# EAGLE design sensor board (EAGLE 7.7.0)
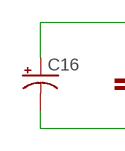
[diagram p0: schematic, sheet 1, part 1 of 2]
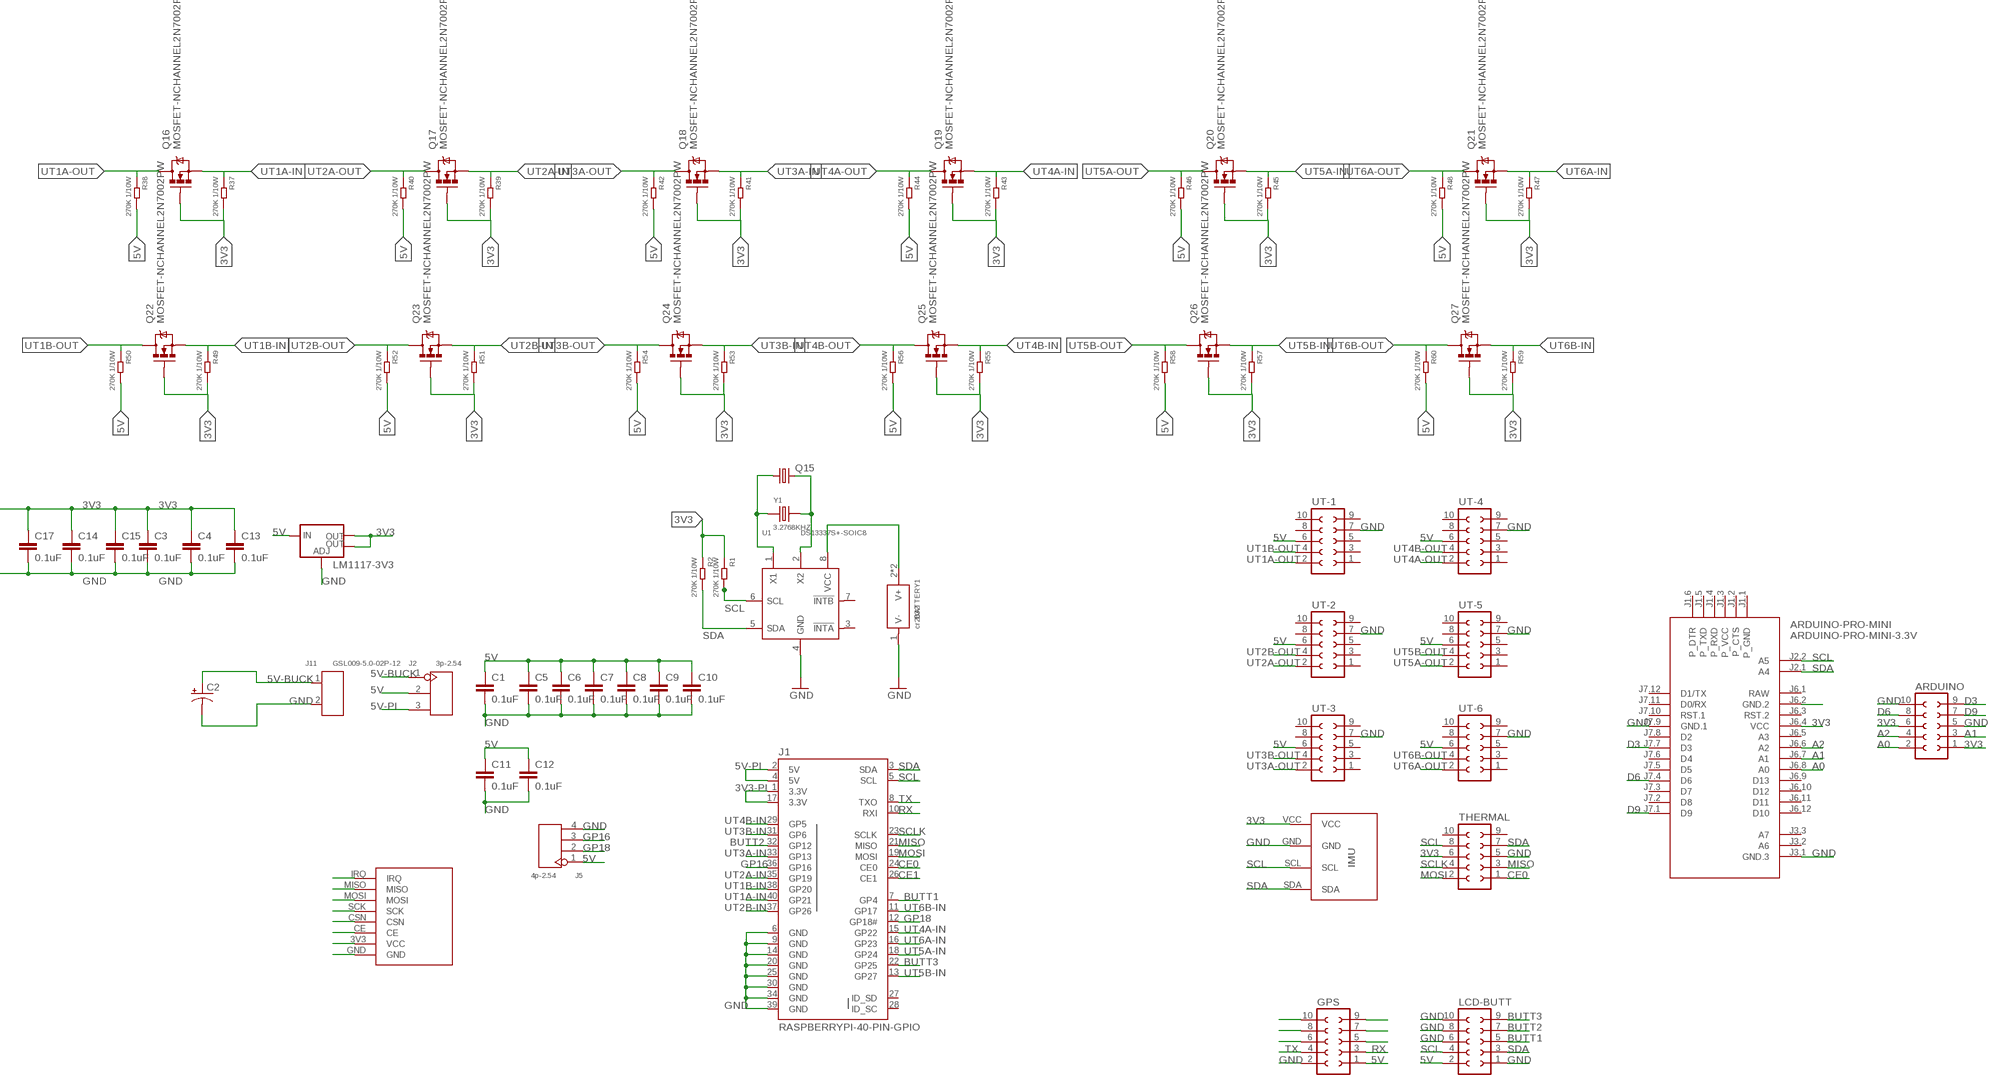
[diagram p1: schematic, sheet 1, part 2 of 2]

## Parts
ARDUINO  SOCKET-10V  [S10V]
ARDUINO-PRO-MINI  ARDUINO-PRO-MINI-3.3V  [ARDUINO-PRO-MINI]
BATTERY1  cr2032  DIP-BATTERY-CELL-HOLDER(2032)  [BAT2P-20.32-CR2032]
C1  0.1uF  0.1UF-100V-10%(0603)  [0603-CAP]
C2  100UF-25V-20%(PTH)  [CPOL-RADIAL-100UF-25V]
C3  0.1uF  0.1UF-100V-10%(0603)  [0603-CAP]
C4  0.1uF  0.1UF-100V-10%(0603)  [0603-CAP]
C5  0.1uF  0.1UF-100V-10%(0603)  [0603-CAP]
C6  0.1uF  0.1UF-100V-10%(0603)  [0603-CAP]
C7  0.1uF  0.1UF-100V-10%(0603)  [0603-CAP]
C8  0.1uF  0.1UF-100V-10%(0603)  [0603-CAP]
C9  0.1uF  0.1UF-100V-10%(0603)  [0603-CAP]
C10  0.1uF  0.1UF-100V-10%(0603)  [0603-CAP]
C11  0.1uF  0.1UF-100V-10%(0603)  [0603-CAP]
C12  0.1uF  0.1UF-100V-10%(0603)  [0603-CAP]
C13  0.1uF  0.1UF-100V-10%(0603)  [0603-CAP]
C14  0.1uF  0.1UF-100V-10%(0603)  [0603-CAP]
C15  0.1uF  0.1UF-100V-10%(0603)  [0603-CAP]
C16  100UF-25V-20%(PTH)  [CPOL-RADIAL-100UF-25V]
C17  0.1uF  0.1UF-100V-10%(0603)  [0603-CAP]
GPS  SOCKET-10V  [S10V]
J1  RASPBERRYPI-40-PIN-GPIO  [2X20-SHROUDED]
J2  3p-2.54  DIP-BLACK-FEMALE-HEADER-VERT(3P-2.54)  [H3-2.54]
J5  4p-2.54  DIP-BLACK-FEMALE-HEADER-VERT(4P-2.54)  [H4-2.54]
J11  GSL009-5.0-02P-12  SCREW-TERMINAL-BLUE(2P-5.0)  [H2-5.0-10.5X8.0MM]
LCD-BUTT  SOCKET-10V  [S10V]
LM1117-3V3  V_REG_LM1117SOT223  [SOT223]
Q15  CRYSTALTC26H  [TC26H]
Q16  MOSFET-NCHANNEL2N7002PW  [SOT323]
Q17  MOSFET-NCHANNEL2N7002PW  [SOT323]
Q18  MOSFET-NCHANNEL2N7002PW  [SOT323]
Q19  MOSFET-NCHANNEL2N7002PW  [SOT323]
Q20  MOSFET-NCHANNEL2N7002PW  [SOT323]
Q21  MOSFET-NCHANNEL2N7002PW  [SOT323]
Q22  MOSFET-NCHANNEL2N7002PW  [SOT323]
Q23  MOSFET-NCHANNEL2N7002PW  [SOT323]
Q24  MOSFET-NCHANNEL2N7002PW  [SOT323]
Q25  MOSFET-NCHANNEL2N7002PW  [SOT323]
Q26  MOSFET-NCHANNEL2N7002PW  [SOT323]
Q27  MOSFET-NCHANNEL2N7002PW  [SOT323]
R1  270K 1/10W  RC0603FR-0720RL(0603)  [R0603]
R2  270K 1/10W  RC0603FR-0720RL(0603)  [R0603]
R37  270K 1/10W  RC0603FR-0720RL(0603)  [R0603]
R38  270K 1/10W  RC0603FR-0720RL(0603)  [R0603]
R39  270K 1/10W  RC0603FR-0720RL(0603)  [R0603]
R40  270K 1/10W  RC0603FR-0720RL(0603)  [R0603]
R41  270K 1/10W  RC0603FR-0720RL(0603)  [R0603]
R42  270K 1/10W  RC0603FR-0720RL(0603)  [R0603]
R43  270K 1/10W  RC0603FR-0720RL(0603)  [R0603]
R44  270K 1/10W  RC0603FR-0720RL(0603)  [R0603]
R45  270K 1/10W  RC0603FR-0720RL(0603)  [R0603]
R46  270K 1/10W  RC0603FR-0720RL(0603)  [R0603]
R47  270K 1/10W  RC0603FR-0720RL(0603)  [R0603]
R48  270K 1/10W  RC0603FR-0720RL(0603)  [R0603]
R49  270K 1/10W  RC0603FR-0720RL(0603)  [R0603]
R50  270K 1/10W  RC0603FR-0720RL(0603)  [R0603]
R51  270K 1/10W  RC0603FR-0720RL(0603)  [R0603]
R52  270K 1/10W  RC0603FR-0720RL(0603)  [R0603]
R53  270K 1/10W  RC0603FR-0720RL(0603)  [R0603]
R54  270K 1/10W  RC0603FR-0720RL(0603)  [R0603]
R55  270K 1/10W  RC0603FR-0720RL(0603)  [R0603]
R56  270K 1/10W  RC0603FR-0720RL(0603)  [R0603]
R57  270K 1/10W  RC0603FR-0720RL(0603)  [R0603]
R58  270K 1/10W  RC0603FR-0720RL(0603)  [R0603]
R59  270K 1/10W  RC0603FR-0720RL(0603)  [R0603]
R60  270K 1/10W  RC0603FR-0720RL(0603)  [R0603]
THERMAL  SOCKET-10V  [S10V]
U1  DS13337S+-SOIC8  CLOCK-DS1337S+(SOIC8)  [SOIC8-1.27-5X4MM]
U$1  IMU  [IMU]
U$2  NRF24L01+  [NRF24L01+]
UT-1  SOCKET-10V  [S10V]
UT-2  SOCKET-10V  [S10V]
UT-3  SOCKET-10V  [S10V]
UT-4  SOCKET-10V  [S10V]
UT-5  SOCKET-10V  [S10V]
UT-6  SOCKET-10V  [S10V]
Y1  3.2768KHZ  SMD-CRYSTAL-32.768KHZ-12.5PF-20PPM-90K(2P-L2.0X1.2MM)  [X2-SMD-L2.0X1.2X0.55MM]

## Nets
3V3: ARDUINO-PRO-MINI.J6.4(VCC) ARDUINO.1 ARDUINO.6 C3.1 C4.1 C13.1 C14.1 C15.1 C16.1(+) C17.1 LM1117-3V3.2(OUT) LM1117-3V3.4(OUT) Q16.1(G) Q17.1(G) Q18.1(G) Q19.1(G) Q20.1(G) Q21.1(G) Q22.1(G) Q23.1(G) Q24.1(G) Q25.1(G) Q26.1(G) Q27.1(G) R1.1 R2.1 R37.2 R39.2 R41.2 R43.2 R45.2 R47.2 R49.2 R51.2 R53.2 R55.2 R57.2 R59.2 THERMAL.6 U$1.VCC U$2.3V3(VCC)
3V3-PI: J1.1(3.3V) J1.17(3.3V)
5V: C1.1 C5.1 C6.1 C7.1 C8.1 C9.1 C10.1 C11.1 C12.1 GPS.1 J2.2 J5.1 LCD-BUTT.2 LM1117-3V3.3(IN) R38.2 R40.2 R42.2 R44.2 R46.2 R48.2 R50.2 R52.2 R54.2 R56.2 R58.2 R60.2 UT-1.6 UT-2.6 UT-3.6 UT-4.6 UT-5.6 UT-6.6
5V-BUCK: C2.1(+) J2.1 J11.1
5V-PI: J1.2(5V) J1.4(5V) J2.3
A0: ARDUINO-PRO-MINI.J6.8(A0) ARDUINO.2
A1: ARDUINO-PRO-MINI.J6.7(A1) ARDUINO.3
A2: ARDUINO-PRO-MINI.J6.6(A2) ARDUINO.4
BUTT1: J1.7(GP4) LCD-BUTT.5
BUTT2: J1.32(GP12) LCD-BUTT.7
BUTT3: J1.22(GP25) LCD-BUTT.9 U$2.CE
CE0: J1.24(CE0) THERMAL.1
CE1: J1.26(CE1) U$2.CSN
D3: ARDUINO-PRO-MINI.J7.7(D3) ARDUINO.9
D6: ARDUINO-PRO-MINI.J7.4(D6) ARDUINO.8
D9: ARDUINO-PRO-MINI.J7.1(D9) ARDUINO.7
GND: ARDUINO-PRO-MINI.J3.1(GND.3) ARDUINO-PRO-MINI.J6.2(GND.2) ARDUINO-PRO-MINI.J7.9(GND.1) ARDUINO.5 ARDUINO.10 BATTERY1.1(V-) C1.2 C2.2(-) C3.2 C4.2 C5.2 C6.2 C7.2 C8.2 C9.2 C10.2 C11.2 C12.2 C13.2 C14.2 C15.2 C16.2(-) C17.2 GPS.2 J1.6(GND) J1.9(GND) J1.14(GND) J1.20(GND) J1.25(GND) J1.30(GND) J1.34(GND) J1.39(GND) J5.4 J11.2 LCD-BUTT.1 LCD-BUTT.6 LCD-BUTT.8 LCD-BUTT.10 LM1117-3V3.1(ADJ) THERMAL.5 U1.4(GND) U$1.GND U$2.GND UT-1.7 UT-2.7 UT-3.7 UT-4.7 UT-5.7 UT-6.7
GP16: J1.36(GP16) J5.3
GP18: J1.12(GP18#) J5.2
MISO: J1.21(MISO) THERMAL.3 U$2.MISO
MOSI: J1.19(MOSI) THERMAL.2 U$2.MOSI
N$8: U$2.IRQ
N$15: GPS.5
N$16: GPS.6
N$17: GPS.8
N$18: GPS.7
N$19: GPS.10
N$20: GPS.9
N$41: BATTERY1.2(V+) BATTERY1.3(V+) U1.8(VCC)
N$42: Q15.1 U1.1(X1) Y1.1
N$43: Q15.2 U1.2(X2) Y1.2
RX: GPS.3 J1.10(RXI)
SCL: ARDUINO-PRO-MINI.J2.2(A5) J1.5(SCL) LCD-BUTT.4 R1.2 THERMAL.8 U1.6(SCL) U$1.SCL
SCLK: J1.23(SCLK) THERMAL.4 U$2.SCK
SDA: ARDUINO-PRO-MINI.J2.1(A4) J1.3(SDA) LCD-BUTT.3 R2.2 THERMAL.7 U1.5(SDA) U$1.SDA
TX: GPS.4 J1.8(TXO)
UT1A-IN: J1.40(GP21) Q16.2(S) R37.1
UT1A-OUT: Q16.3(D) R38.1 UT-1.2
UT1B-IN: J1.38(GP20) Q22.2(S) R49.1
UT1B-OUT: Q22.3(D) R50.1 UT-1.4
UT2A-IN: J1.35(GP19) Q17.2(S) R39.1
UT2A-OUT: Q17.3(D) R40.1 UT-2.2
UT2B-IN: J1.37(GP26) Q23.2(S) R51.1
UT2B-OUT: Q23.3(D) R52.1 UT-2.4
UT3A-IN: J1.33(GP13) Q18.2(S) R41.1
UT3A-OUT: Q18.3(D) R42.1 UT-3.2
UT3B-IN: J1.31(GP6) Q24.2(S) R53.1
UT3B-OUT: Q24.3(D) R54.1 UT-3.4
UT4A-IN: J1.15(GP22) Q19.2(S) R43.1
UT4A-OUT: Q19.3(D) R44.1 UT-4.2
UT4B-IN: J1.29(GP5) Q25.2(S) R55.1
UT4B-OUT: Q25.3(D) R56.1 UT-4.4
UT5A-IN: J1.18(GP24) Q20.2(S) R45.1
UT5A-OUT: Q20.3(D) R46.1 UT-5.2
UT5B-IN: J1.13(GP27) Q26.2(S) R57.1
UT5B-OUT: Q26.3(D) R58.1 UT-5.4
UT6A-IN: J1.16(GP23) Q21.2(S) R47.1
UT6A-OUT: Q21.3(D) R48.1 UT-6.2
UT6B-IN: J1.11(GP17) Q27.2(S) R59.1
UT6B-OUT: Q27.3(D) R60.1 UT-6.4
Unconnected: ARDUINO-PRO-MINI.J1.1(P_GND) ARDUINO-PRO-MINI.J1.2(P_CTS) ARDUINO-PRO-MINI.J1.3(P_VCC) ARDUINO-PRO-MINI.J1.4(P_RXD) ARDUINO-PRO-MINI.J1.5(P_TXD) ARDUINO-PRO-MINI.J1.6(P_DTR) ARDUINO-PRO-MINI.J3.2(A6) ARDUINO-PRO-MINI.J3.3(A7) ARDUINO-PRO-MINI.J6.3(RST.2) ARDUINO-PRO-MINI.J6.5(A3) ARDUINO-PRO-MINI.J6.9(D13) ARDUINO-PRO-MINI.J6.10(D12) ARDUINO-PRO-MINI.J6.11(D11) ARDUINO-PRO-MINI.J6.12(D10) ARDUINO-PRO-MINI.J7.2(D8) ARDUINO-PRO-MINI.J7.3(D7) ARDUINO-PRO-MINI.J7.5(D5) ARDUINO-PRO-MINI.J7.6(D4) ARDUINO-PRO-MINI.J7.8(D2) ARDUINO-PRO-MINI.J7.10(RST.1) ARDUINO-PRO-MINI.J7.11(D0/RX) ARDUINO-PRO-MINI.J7.12(D1/TX) J1.27(ID_SD) J1.28(ID_SC) THERMAL.9 THERMAL.10 U1.3(!INTA!) U1.7(!INTB!) UT-1.1 UT-1.3 UT-1.5 UT-1.8 UT-1.9 UT-1.10 UT-2.1 UT-2.3 UT-2.5 UT-2.8 UT-2.9 UT-2.10 UT-3.1 UT-3.3 UT-3.5 UT-3.8 UT-3.9 UT-3.10 UT-4.1 UT-4.3 UT-4.5 UT-4.8 UT-4.9 UT-4.10 UT-5.1 UT-5.3 UT-5.5 UT-5.8 UT-5.9 UT-5.10 UT-6.1 UT-6.3 UT-6.5 UT-6.8 UT-6.9 UT-6.10

## Power pins joined to a net without a drawn wire
RAW: ARDUINO-PRO-MINI.J6.1(RAW)

## Library data of the parts
ARDUINO GPS LCD-BUTT THERMAL UT-1-UT-6 = con-3m-skt-header:SOCKET-10: 10 pin PCB Socket (3m 85xx/51xx)
ARDUINO-PRO-MINI = diy-modules:ARDUINO-PRO-MINI-*: Arduino Pro Mini and compatible devices More details available here: https://www.arduino.cc/en/Main/ArduinoBoardProMini Click here to find device on ebay.com <http://www.ebay.com/sch/arduino+pro+mini>
BATTERY1 = Seeed-OPL-Connector:DIP-BATTERY-CELL-HOLDER(2032): 320170003
C1 C3-C15 C17 = SparkFun-Capacitors:0.1UF-100V-10%(0603): CAP-08390; PROD_ID: CAP-08390
C2 C16 = SparkFun-Capacitors:100UF-25V-20%(PTH): CAP-08439; PROD_ID: CAP-08439
J1 = SparkFun-Boards:RASPBERRYPI-40-PIN-GPIO: Second Generation Raspberry Pi GPIO Header 2x20 pin connector, as found on B, B+, A+ models.
J2 = Seeed-OPL-Connector:DIP-BLACK-FEMALE-HEADER-VERT(3P-2.54): 320030024; MPN: F185-1103A0BSYA1
J5 = Seeed-OPL-Connector:DIP-BLACK-FEMALE-HEADER-VERT(4P-2.54): 320030017; MPN: F185-1104A1BSYA1
J11 = Seeed-OPL-Connector:SCREW-TERMINAL-BLUE(2P-5.0): 320120007; MPN: GSL009-5.0-02P-12
LM1117-3V3 = SparkFun-PowerIC:V_REG_LM1117: Voltage Regulator LM1117 Standard adjustable voltage regulator but in SMD form. Spark Fun Electronics SKU : COM-00595; PROD_ID: VREG-08170
Q15 = crystal:CRYSTAL: CRYSTAL; OC_FARNELL: unknown; OC_NEWARK: unknown
Q16-Q27 = SparkFun-DiscreteSemi:MOSFET-NCHANNEL: Common NMOSFET Parts MFG P/N Store ID Prod ID FDD8780 TRANS-09984 SI7820DN TRANS-11055 FDS6630A IC-08089 2N7002PW TRANS-11151 FQP30N06L COM-10213 TRANS-10060 BSS123LT1G TRANS-08345 BSS138 TRANS-00830 BS170 2N7000; PROD_ID: TRANS-11151
R1 R2 R37-R60 = Seeed-OPL-Resistor:RC0603FR-0720RL(0603): 301010187; MPN: RC0603FR-07270KL
U1 = Seeed-OPL-ic:CLOCK-DS1337S+(SOIC8): 310110008; MPN: DS1337S+
U$1 = EjaadTech:IMU
U$2 = EjaadTech:NRF24L01+
Y1 = Seeed-OPL-crystal-osctllator:SMD-CRYSTAL-32.768KHZ-12.5PF-20PPM-90K(2P-L2.0X1.2MM): 306010020; MPN: FC-12M

## Board
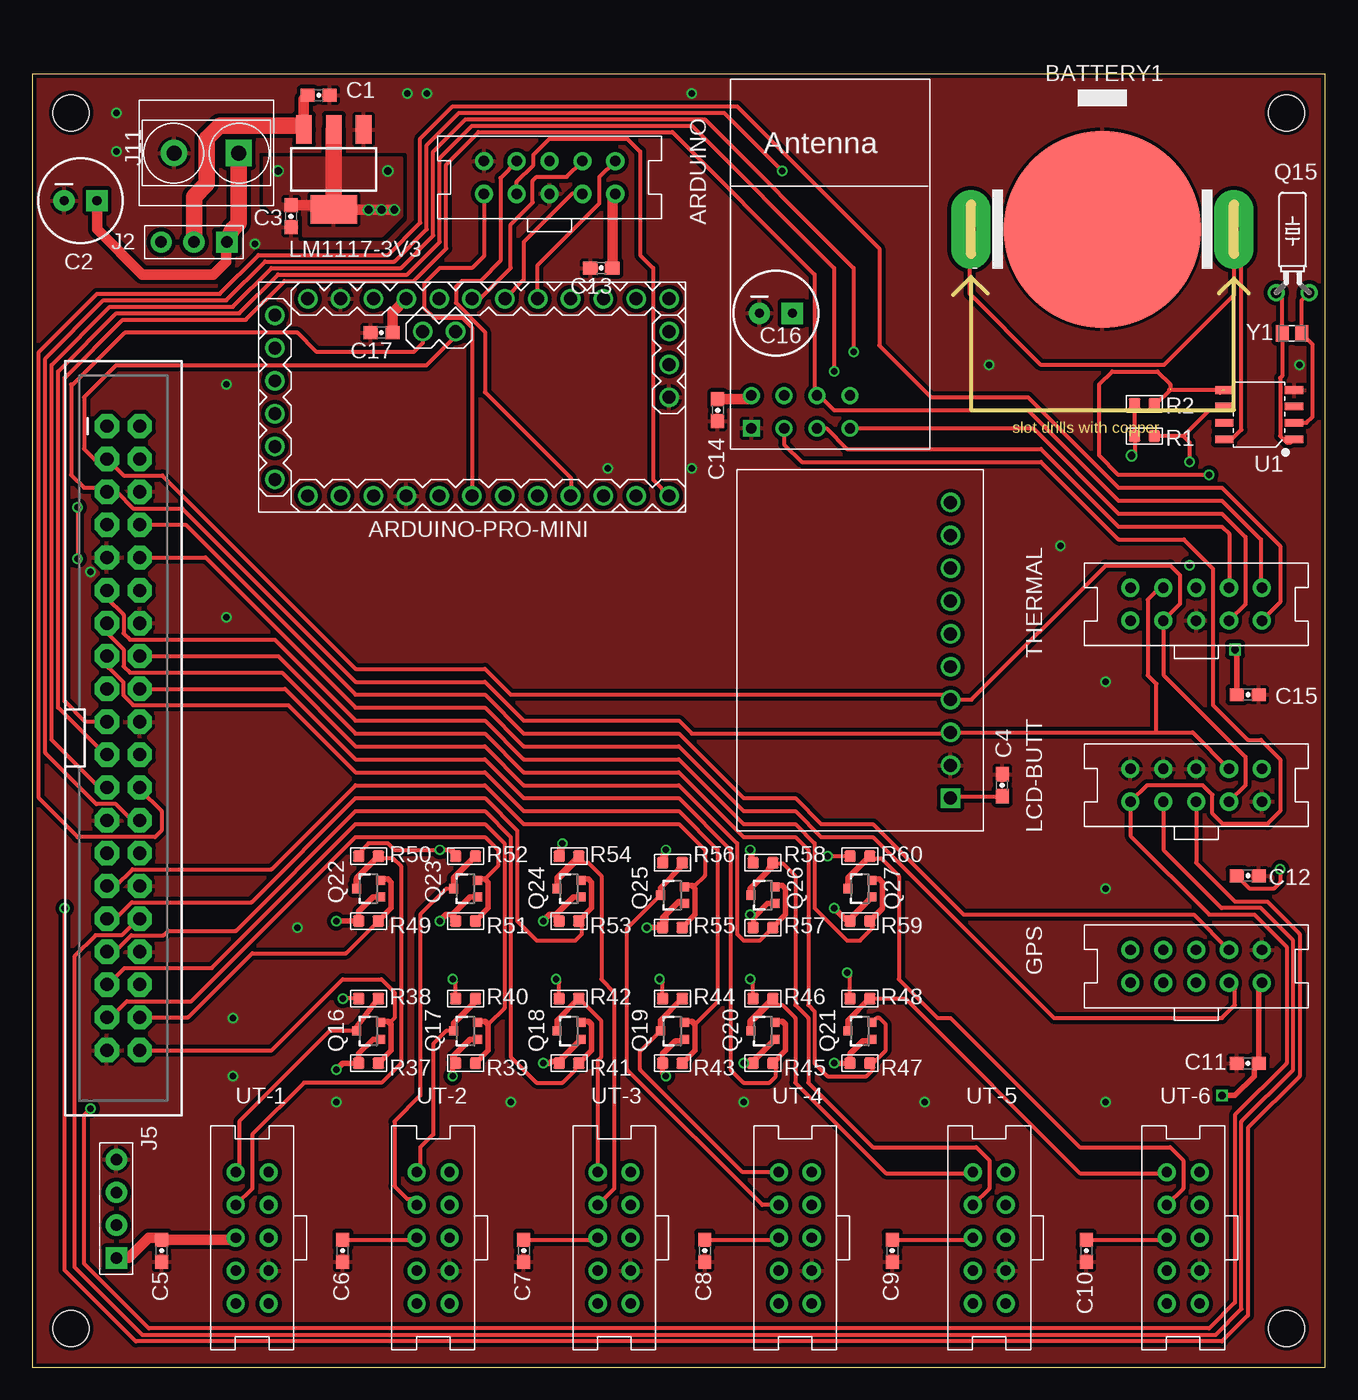
[diagram p2: board, top side]
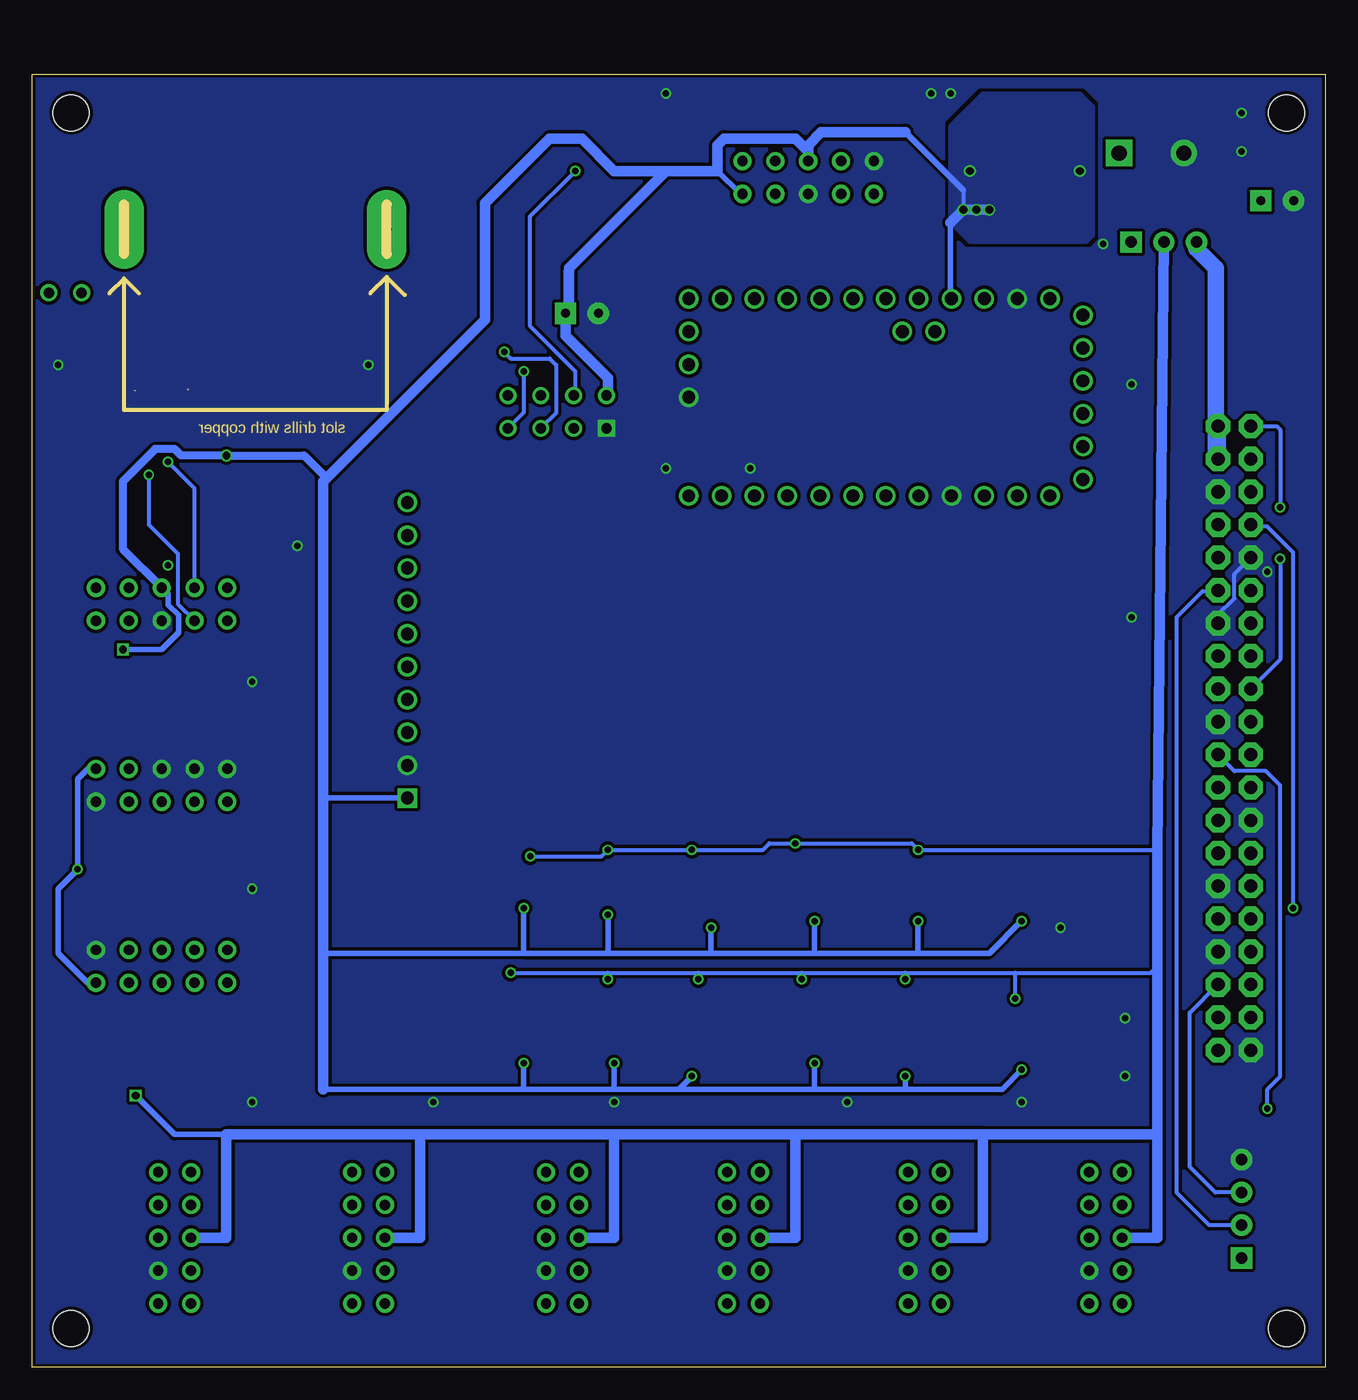
[diagram p3: board, bottom side, seen from below]

Size 100 x 100 mm. Coordinates in mm from the lower left corner, seen from the top.
Outline: 100,100 0,100 0,0 100,0 100,100
Copper layers (1*16): Top 0.035mm / dielectric 1.5mm / Bottom 0.035mm
Design rules "SeeedStudio_2layer_DRU_no_angle_20140221": minimum track width 6mil, minimum drill 12mil, track to track 6mil, track to pad 6mil, pad to pad 6mil, via to via 6mil, smd to smd 0mil, copper to edge 10mil, drill to drill 10mil, minimum pad ring 10mil, minimum via ring 6mil, stop-mask expansion 2mil, vias tented up to drill 100mil, thermal gap 10mil
Holes 2.8 mm at 97,3 3,3 3,97 97,97

### Footprints (pad centres in the part's own frame; a part is rotated, then mirrored left to right if it is on the bottom)
S10V = drill 0.8 pad 1.4: 1 5.08,-1.27; 2 5.08,1.27; 3 2.54,-1.27; 4 2.54,1.27; 5 0,-1.27; 6 0,1.27; 7 -2.54,-1.27; 8 -2.54,1.27; 9 -5.08,-1.27; 10 -5.08,1.27
ARDUINO-PRO-MINI = drill 1: J1.1 -15.24,6.35; J1.2 -15.24,3.81; J1.3 -15.24,1.27; J1.4 -15.24,-1.27; J1.5 -15.24,-3.81; J1.6 -15.24,-6.35; J2.1 -1.27,5.08; J2.2 -3.81,5.08; J3.1 15.24,0; J3.2 15.24,2.54; J3.3 15.24,5.08; J6.1 -12.7,7.62; J6.2 -10.16,7.62; J6.3 -7.62,7.62; J6.4 -5.08,7.62; J6.5 -2.54,7.62; J6.6 0,7.62; J6.7 2.54,7.62; J6.8 5.08,7.62; J6.9 7.62,7.62; J6.10 10.16,7.62; J6.11 12.7,7.62; J6.12 15.24,7.62; J7.1 15.24,-7.62; J7.2 12.7,-7.62; J7.3 10.16,-7.62; J7.4 7.62,-7.62; J7.5 5.08,-7.62; J7.6 2.54,-7.62; J7.7 0,-7.62; J7.8 -2.54,-7.62; J7.9 -5.08,-7.62; J7.10 -7.62,-7.62; J7.11 -10.16,-7.62; J7.12 -12.7,-7.62
BAT2P-20.32-CR2032 = smd 15.24 x 15.24: 1 0,0 | drill 0.762 pad 3.048 long: 2 -10.16,0; 3 10.16,0
0603-CAP = smd 1.1 x 1: 1 -0.85,0; 2 0.85,0
CPOL-RADIAL-100UF-25V = drill 0.7 pad 1.651 square: 1 1.27,0 | drill 0.7 pad 1.651: 2 -1.27,0
2X20-SHROUDED = drill 1.016 pad 1.88 octagon: 1 -1.27,24.13; 2 1.27,24.13; 3 -1.27,21.59; 4 1.27,21.59; 5 -1.27,19.05; 6 1.27,19.05; 7 -1.27,16.51; 8 1.27,16.51; 9 -1.27,13.97; 10 1.27,13.97; 11 -1.27,11.43; 12 1.27,11.43; 13 -1.27,8.89; 14 1.27,8.89; 15 -1.27,6.35; 16 1.27,6.35; 17 -1.27,3.81; 18 1.27,3.81; 19 -1.27,1.27; 20 1.27,1.27; 21 -1.27,-1.27; 22 1.27,-1.27; 23 -1.27,-3.81; 24 1.27,-3.81; 25 -1.27,-6.35; 26 1.27,-6.35; 27 -1.27,-8.89; 28 1.27,-8.89; 29 -1.27,-11.43; 30 1.27,-11.43; 31 -1.27,-13.97; 32 1.27,-13.97; 33 -1.27,-16.51; 34 1.27,-16.51; 35 -1.27,-19.05; 36 1.27,-19.05; 37 -1.27,-21.59; 38 1.27,-21.59; 39 -1.27,-24.13; 40 1.27,-24.13
H3-2.54 = drill 0.889 pad 1.651 square: 1 0,2.54 | drill 0.889 pad 1.651: 2 0,0; 3 0,-2.54
H4-2.54 = drill 0.889 pad 1.651 square: 1 0,3.81 | drill 0.889 pad 1.651: 2 0,1.27; 3 0,-1.27; 4 0,-3.81
H2-5.0-10.5X8.0MM = drill 1.168 pad 2.032 square: 1 0,2.5 | drill 1.168 pad 2.032: 2 0,-2.5
SOT223 = smd 1.219 x 2.235: 1 -2.311,-3.099; 2 0,-3.099; 3 2.311,-3.099 | smd 3.6 x 2.2: 4 0,3.099
TC26H = drill 0.813: 1 -1.27,0; 2 1.27,0
SOT323 = smd 0.7 x 0.7: 1 -0.65,-0.925; 2 0.65,-0.925; 3 0,0.925
R0603 = smd 0.889 x 0.889: 1 0,0.762; 2 0,-0.762
SOIC8-1.27-5X4MM = smd 0.6 x 1.4: 1 -1.905,-2.7; 2 -0.635,-2.7; 3 0.635,-2.7; 4 1.905,-2.7; 5 1.905,2.7; 6 0.635,2.7; 7 -0.635,2.7; 8 -1.905,2.7
IMU = drill 1: GND 0,2.54; P$5 0,10.16; P$6 0,12.7; P$7 0,15.24; P$8 0,17.78; P$9 0,20.32; P$10 0,22.86; SCL 0,5.08; SDA 0,7.62 | drill 1 square: VCC 0,0
NRF24L01+ = drill 0.8: 3V3 1.6,4.14; CE 4.14,1.6; CSN 4.14,4.14; IRQ 9.22,4.14; MISO 9.22,1.6; MOSI 6.68,4.14; SCK 6.68,1.6 | drill 0.8 square: GND 1.6,1.6
X2-SMD-L2.0X1.2X0.55MM = smd 1 x 1.25: 1 -0.75,0; 2 0.75,0

### Placement (x,y rotation side)
ARDUINO  40,92 0 top
ARDUINO-PRO-MINI  34,75 0 top
BATTERY1  82.75,87.99 0 top
C1  22.15,98.36 0 top
C2  3.73,90.2 0 top
C3  20,89 270 top
C4  75,45 90 top
C5  10,9 270 top
C6  24,9 270 top
C7  38,9 270 top
C8  52,9 270 top
C9  66.5,9 270 top
C10  81.5,9 270 top
C11  94,23.5 180 top
C12  94,38 0 top
C13  44,85 180 top
C14  53,74 270 top
C15  94,52 0 top
C16  57.5,81.5 0 top
C17  27,80 180 top
GPS  90,31 0 top
J1  7.04,48.64 0 top
J2  12.5,87 270 top
J5  6.5,12.25 180 top
J11  13.46,93.89 270 top
LCD-BUTT  90,45 0 top
LM1117-3V3  23.31,92.61 180 top
Q15  97.46,83.09 0 top
Q16  26,26 90 top
Q17  33.5,26 90 top
Q18  41.5,26 90 top
Q19  49.5,26 90 top
Q20  56.5,26 90 top
Q21  64,26 90 top
Q22  26,37 90 top
Q23  33.5,37 90 top
Q24  41.5,37 90 top
Q25  49.5,36.5 90 top
Q26  56.5,36.5 90 top
Q27  64,37 90 top
R1  86,72 90 top
R2  86,74.5 90 top
R37  26,23.5 270 top
R38  26,28.5 270 top
R39  33.5,23.5 270 top
R40  33.5,28.5 270 top
R41  41.5,23.5 270 top
R42  41.5,28.5 270 top
R43  49.5,23.5 270 top
R44  49.5,28.5 270 top
R45  56.5,23.5 270 top
R46  56.5,28.5 270 top
R47  64,23.5 270 top
R48  64,28.5 270 top
R49  26,34.5 270 top
R50  26,39.5 270 top
R51  33.5,34.5 270 top
R52  33.5,39.5 270 top
R53  41.5,34.5 270 top
R54  41.5,39.5 270 top
R55  49.5,34 270 top
R56  49.5,39 270 top
R57  56.5,34 270 top
R58  56.5,39 270 top
R59  64,34.5 270 top
R60  64,39.5 270 top
THERMAL  90,59 0 top
U1  94.87,73.66 90 top
U$1  71,44 0 top
U$2  54,71 0 top
UT-1  17,10 90 top
UT-2  31,10 90 top
UT-3  45,10 90 top
UT-4  59,10 90 top
UT-5  74,10 90 top
UT-6  89,10 90 top
Y1  97.4,79.94 0 top

### Tracks (layer width: path | path; a pad name or v marks a point on that pad's centre or on a via)
3V3  (via drill 0.5, 0.6)
  Top 0.305: R2.1 R1.1 85.24,70.74 v85,70.5 | 70.85,44.15 C4.1
  Top 0.406: Q22.1 26.35,36.35 25.25,35.25 25.25,34.76 R49.2 v23.5,34.5 | Q16.1 26.35,25.35 25.25,24.25 25.25,23.51 R37.2 24,23.5 v23.5,23 | Q23.1 33.85,36.35 32.5,35 | 32.5,35 32.5,34.49 R51.2 | Q17.1 33.85,25.35 32.5,24 32.5,23.49 | 32.5,23.49 R39.2 | R41.2 40.74,23.66 | 40.74,23.66 Q18.1 | Q24.1 41.85,36.35 40.5,35 | 40.5,35 40.5,34.49 R53.2 | Q19.1 50.33,25.25 49.75,25.25 48.74,24.24 R43.2 48.74,22.76 v49,22.5 | R45.2 55.74,23.66 | 55.74,23.66 Q20.1 | Q26.1 56.85,35.85 55.75,34.75 | 55.75,34.75 55.75,34.01 R57.2 | 64.85,25.35 Q21.1 64.83,25.25 64.25,25.25 63.24,24.24 63.24,23.74 | R59.2 63.24,34.66 | 63.24,34.66 Q27.1 | R47.2 63.24,23.74 | 32.5,23.49 v32.5,22.5 | 40.74,23.66 40.16,23.66 40,23.5 v39.5,23.5 | 55.74,23.66 55.16,23.66 v55,23.5 | 63.24,23.74 63,23.5 v62,23.5 | 63.24,34.66 62.84,34.66 v62,35.5 | 32.5,35 32,35 v31.5,34.5 | 40.5,35 40,35 v39.5,34.5 | R55.2 48.74,34.74 49,35 | 50,36 50.27,36 Q25.1 50.15,35.85 50,36 | 55.75,34.75 v55.5,35 | 50,36 49,35 | 49,35 49,34.5 48.5,34 v47.5,34 | 70.85,44.15 U$1.VCC | C15.1 93.15,55.35 v93,55.5
  Top 0.813: v27,89.5 v26,89.5 v25.99,89.51 LM1117-3V3.4 22.97,89.85 C3.1 | 27.5,89.5 v28,89.5 | C14.1 55.31,74.85 U$2.3V3 | C17.1 27.85,81.55 ARDUINO-PRO-MINI.J6.4 | C13.1 44.85,90.5 ARDUINO.1
  Top 1.27: LM1117-3V3.4 LM1117-3V3.2
  Bottom 0.305: 58.77,79.77 58.77,84.73 58.5,85 | 28,91 v28,89.5
  Bottom 0.406: 29,88.5 29,82.7 | 45.23,90.73 47,92.5 | 77.5,21.5 62,21.5 | 62,21.5 55,21.5 | 55,21.5 50,21.5 | 50,21.5 39.5,21.5 | 39.5,21.5 32.5,21.5 | 32.5,21.5 25,21.5 v23.5,23 | v32.5,22.5 32.5,21.5 | v39.5,23.5 39.5,21.5 | v49,22.5 50,21.5 | v55,23.5 55,21.5 | v62,23.5 62,21.5 | 62,32 77.5,32 | v62,35.5 62,32 | 62,32 55.5,32 | 55.5,32 47.5,32 | 47.5,32 39.5,32 | 39.5,32 31.5,32 | 31.5,32 26,32 v23.5,34.5 | v31.5,34.5 31.5,32 | v39.5,34.5 39.5,32 | v55.5,35 55.5,32 | v47.5,34 47.5,32 | U$1.VCC 77.5,44 | v93,55.5 90,55.5 88.7,56.8 88.7,58.15 89.5,58.95 89.5,59.77 THERMAL.6 | 32.5,95.5 28,91
  Bottom 0.61: 77.25,68.75 79,70.5 v85,70.5 88.5,70.5 89,71 90.5,71 93,68.5 93,63.27 THERMAL.6
  Bottom 0.813: 29,82.7 ARDUINO-PRO-MINI.J6.4 | v26,89.5 v27,89.5 v28,89.5 29,88.5 | 45.31,90.5 ARDUINO.1 45.23,90.73 | U$2.3V3 55.5,75.24 55.5,76.5 58.77,79.77 C16.1 58.5,81.77 58.5,85 51,92.5 | 51,92.5 47,92.5 47,94.5 46.5,95 41,95 40,94 ARDUINO.6 40,94.5 39,95.5 32.5,95.5 | 51,92.5 55,92.5 57.5,95 60,95 65,90 65,81 77.25,68.75 77.5,68.5 77.5,44 77.5,32 77.5,21.5
  other vias: 27.5,92.5 19,92.5
  pour Top (isolate 0.305, no thermals): 19,90 19.5,89.5 20.5,89.5
  pour Bottom (isolate 0.305): 18.5,87 27.5,87 29,88.5 29,96 27.5,97.5 26.5,98.5 19,98.5 18,97.5 18,87.5
  pour Top: 20.5,89.5 18.5,89.5 18,90 18,93.5 28.5,93.5 28.5,89 27,87.5 21,87.5 21,89
3V3-PI  (via drill 0.5)
  Top 0.305: v3.5,66.5 v3.5,62.5
  Bottom 0.305: J1.1 3.77,72.77 3.5,72.5 v3.5,66.5 | v3.5,62.5 3.5,54.72 J1.17
5V  (via drill 0.5, 0.6)
  Top 0.305: R60.2 v61.5,39.5 | v31.5,40 32.24,40 R52.2 32.74,39.76 32.5,40 v31.5,40 | R50.2 25.5,39.76 25.5,40 26,40.5 27.5,40.5 28,40 v31.5,40 | R48.2 63.24,30.26 v63,30.5 | R46.2 55.74,29.76 v55.5,30 | R44.2 48.74,29.76 v48.5,30 | R42.2 40.74,29.76 v40.5,30 | R40.2 32.74,29.76 v32.5,30 | R38.2 v24,28.5 | C10.1 87.58,9.85 UT-6.6 | C9.1 72.58,9.85 UT-5.6 | C8.1 57.58,9.85 UT-4.6 | C7.1 43.58,9.85 UT-3.6 | C6.1 29.58,9.85 UT-2.6 | v96.5,38.5 96.5,37.5 96,37 94.15,37 C12.1 | v55.5,40 55.5,39.24 R58.2 55.74,39.76 v55.5,40 | v49,40 49,39.26 R56.2 48.74,39.74 v49,40 | v41,40.5 41,39.76 R54.2 40.74,40.24 v41,40.5
  Top 0.406: 93,38.15 C12.1 | v92,21 93,21 94.5,22.5 94.5,23.15 C11.1 94.85,29.5 GPS.1
  Top 0.813: LM1117-3V3.3 21,98.06 C1.1 | J5.1 7.44,8.44 9,10 9.85,10 C5.1 15.58,9.85 UT-1.6
  Top 1.27: J2.2 12.5,90.5 13.5,91.5 13.5,95 14.5,96 20.71,96 LM1117-3V3.3
  Bottom 0.305: v61.5,39.5 56,39.5 v55.5,40 v49,40 43.5,40 43,40.5 v41,40.5 32,40.5 v31.5,40 13,40 | v63,30.5 55.5,30.5 | 55.5,30.5 48.5,30.5 | 48.5,30.5 40.5,30.5 | 40.5,30.5 32.5,30.5 | 32.5,30.5 24,30.5 | 24,30.5 13.5,30.5 13,31 | v55.5,30 55.5,30.5 | v48.5,30 48.5,30.5 | v40.5,30 40.5,30.5 | v32.5,30 32.5,30.5 | v24,28.5 24,30.5
  Bottom 0.406: LCD-BUTT.2 95.73,46.27 96.5,45.5 v96.5,38.5 98,37 98,32 95.73,29.73 GPS.1 | 85,18 89,18 v92,21
  Bottom 0.813: J2.2 13,40 13,31 13,18 | 13,18 13,10 UT-1.6 | UT-2.6 26.5,10 26.5,18 | 26.5,18 13,18 | 26.5,18 41,18 | 41,18 55,18 | 55,18 70,18 | 70,18 85,18 85,10 UT-6.6 | UT-5.6 70,10 70,18 | UT-4.6 55,10 55,18 | UT-3.6 41,10 41,18
5V-BUCK
  Top 0.813: C2.1 5,88 8.5,84.5 14,84.5 15,85.5 15,85.96 J2.1
  Top 1.27: J11.1 15.96,88.46 15.5,88 15,87.04 J2.1
5V-PI
  Bottom 1.27: J2.3 10,86.5 8.5,85 8.5,70.42 J1.4 J1.2
A0
  Top 0.305: ARDUINO-PRO-MINI.J6.8 39.08,85.23 43.85,90 43.85,92.04 ARDUINO.2
A1
  Top 0.305: ARDUINO.3 41.73,90.73 38,87 38,84.08 ARDUINO-PRO-MINI.J6.7
A2
  Top 0.305: ARDUINO-PRO-MINI.J6.6 34.62,82.62 37,85 37,88.35 38.7,90.05 38.7,91.75 39,92.05 41.32,92.05 ARDUINO.4
BUTT1  (via drill 0.5)
  Top 0.305: LCD-BUTT.5 90,39 93,36 95.5,36 98,33.5 98,22.5 94,18.5 94,4 92,2 8,2 2.5,7.5 v2.5,35.5
  Bottom 0.305: v2.5,35.5 2.5,63 4.5,65 5.62,65 J1.7
BUTT2
  Top 0.305: J1.32 8.17,34.67 6.9,33.4 4.9,33.4 3.25,31.75 3.25,7.75 8.5,2.5 91.5,2.5 93.5,4.5 93.5,19 97.5,23 97.5,33 95,35.5 91.95,35.5 87.5,39.95 87.5,43.69 LCD-BUTT.7
BUTT3  (via drill 0.5)
  Top 0.305: v4.5,20 4,19.5 4,8 9,3 91,3 93,5 93,19.5 97,23.5 97,32.5 94.5,35 91,35 84.92,41.08 LCD-BUTT.9 86.19,45 90.5,45 91.25,44.25 91.25,42.8 92.05,42 95.5,42 96.5,43 96.5,47 95,48.5 94,48.5 91.3,51.2 91.3,61.75 89.05,64 84,64 78,70 59.5,70 58.14,71.36 U$2.CE
  Bottom 0.305: v4.5,20 4.5,21.5 3.5,22.5 3.5,45 4.6,46.1 7.04,46.1 J1.22
CE0
  Top 0.305: J1.24 8.31,44.69 10,43 10,41.5 9.5,41 3.5,41 0.5,44 0.5,78.5 5,83 14.5,83 17.5,86 27.5,86 30,88.5 30,95 32.5,97.5 54.5,97.5 65.5,86.5 65.5,79 69.5,75 77,75 84,68 92,68 96.5,63.5 96.5,59.15 THERMAL.1
CE1  (via drill 0.5)
  Top 0.305: J1.26 7.71,42.29 6.45,43.55 4.95,43.55 1,47.5 1,78 5.5,82.5 15,82.5 18,85.5 28,85.5 30.5,88 30.5,94.5 33,97 53.5,97 v58,92.5
  Bottom 0.305: U$2.CSN 58,75.28 58,77 61.5,80.5 61.5,89 v58,92.5
D3
  Top 0.305: ARDUINO.9 34.92,85.92 34,85 31.5,85 30.3,83.8 30.3,81.9 31.05,81.15 33.25,81.15 34,80.4 ARDUINO-PRO-MINI.J7.7
D6
  Top 0.305: ARDUINO.8 37.46,93.21 36.2,91.95 36.2,85.55 34.65,84 33.2,84 32.75,83.55 32.75,82.3 35,80.05 35,75.4 41.65,68.75 41.65,67.41 ARDUINO-PRO-MINI.J7.4
D9
  Top 0.305: ARDUINO.7 37.46,91.66 38.75,92.95 38.75,93.75 40,95 46,95 47,94 47,86 48,85 48,68.62 ARDUINO-PRO-MINI.J7.1
GND  (via drill 0.5)
  Bottom 0.305: J1.14 8.31,58.19 7.05,59.45 7.05,61.33 J1.9
  other vias: 98,77.5 15,58 4.5,61.5 29,98.5 6.5,97 30.5,98.5 17.2,86.85 6.5,94 51,98.5 15.5,27 20.5,34 15.5,22.5 23.5,20.5 37,20.5 55,20.5 69,20.5 83,20.5 83,37 83,53 79.5,63.5 74,77.5 51,69.5 44.5,69.5 15,76
  pour Top (isolate 0.305, rank 2): -10,116 115.5,116 123,108.5 123,-6.5 116,-13.5 -9,-13.5 -21.5,-1 -21.5,104.5
  pour Bottom (isolate 0.254, rank 2, no thermals): -5,108.5 113.5,108.5 113.5,-3 -10,-3 -12.5,-0.5 -12.5,101
GP16
  Bottom 0.305: J5.3 8.52,13.52 10.5,15.5 10.5,27.4 J1.36
GP18
  Bottom 0.305: J5.2 8.98,10.98 11.5,13.5 11.5,58 9.5,60 8.38,60 J1.12
MISO  (via drill 0.5)
  Top 0.305: U$2.MISO 77.4,72.6 84,66 92,66 93.8,64.2 93.8,58.99 THERMAL.3 | J1.21 5.63,47.37 2,51 2,77 6.5,81.5 16,81.5 19,84.5 29,84.5 31.5,87 31.5,93.5 34,96 51,96 62,85 v62,77
  Bottom 0.305: v62,77 62,73.82 U$2.MISO
MOSI
  Top 0.305: THERMAL.2 95,60.35 95,64 92,67 84,67 77,74 62,74 60.86,75.14 U$2.MOSI 60.5,75.32 60.5,84.5 49.5,95.5 34.5,95.5 32,93 32,86.5 29.5,84 19.5,84 16.5,81 7,81 2.5,76.5 2.5,51.5 4.09,49.91 J1.19
N$1  (via drill 0.5)
  other vias: 89.5,62
N$41
  Top 0.305: U1.8 92.75,71.75 93.5,72.5 93.5,87.4 BATTERY1.3 92.91,82.91 87.5,77.5 78,77.5 72.5,83 72.5,87.9 BATTERY1.2
N$42
  Top 0.305: Q15.1 96.65,82.63 Y1.1 96.65,76.65 96.5,76.5 96.5,72 97,71.5 97.31,71.5 U1.1
N$43
  Top 0.305: Q15.2 98.15,82.51 Y1.2 99,79.09 99,73.5 98.53,73.03 U1.2
RX
  Top 0.305: J1.10 13.39,62.61 25,51 35,51 38,48 50,48 55,43 59,43 61,41 65,41 79,27 92,27 93,28 93,29.27 GPS.3
SCL  (via drill 0.5)
  Top 0.305: 86.92,49.08 U$1.SCL 70.92,49 51,49 50,50 38,50 35,53 25,53 11.6,66.4 7.8,66.4 6.51,67.69 J1.5 5.46,68 4,68 3,69 3,76 3.16,76 7.16,80 20.5,80 22,78.5 29.5,78.5 30.19,79.19 ARDUINO-PRO-MINI.J2.2 | 86.92,49.08 89.73,49.08 LCD-BUTT.4 | 89,72 91,74 91.88,74 U1.6 | THERMAL.8 87.17,60.27 86.25,59.35 86.25,53.5 86.92,52.83 86.92,49.08 | v89.5,70 89.5,71.5 89,72 | 89,72 R1.2
  Bottom 0.305: THERMAL.8 87.46,67.96 v89.5,70
SCLK  (via drill 0.5)
  Top 0.305: U$2.SCK 61.4,72.6 63,71 78,71 84,65 92,65 92.55,64.45 THERMAL.4 | J1.23 5.17,44.83 1.5,48.5 1.5,77.5 6,82 15.5,82 18.5,85 28.5,85 31,87.5 31,94 33.5,96.5 52,96.5 63.5,85 v63.5,78.5
  Bottom 0.305: v63.5,78.5 63,78 60,78 59.5,77.5 59.5,73.78 U$2.SCK
SDA  (via drill 0.5)  (2 unrouted)
  Top 0.305: U1.5 88,75.56 | 88,75.56 87.89,75.56 | ARDUINO-PRO-MINI.J2.1 32.73,79.73 30.45,77.45 6.45,77.45 4,75 4,71 5,70 5.54,70 J1.3 7.05,68.95 10.05,68.95 25,54 35,54 37,52 70.62,52 U$1.SDA 72.62,51.62 83,62 88,62 88.75,61.25 88.75,59.02 THERMAL.7 87.46,53.54 93.8,47.2 93.8,44.99 LCD-BUTT.3 | 91.83,75.33 92,75.5 | v91,69 84,69 82.5,70.5 82.5,76 83.5,77 87,77 88,76 88,75.67 | R2.2 86.94,74.5 88,75.56
  Bottom 0.305: v91,69 91,65.15 88.75,62.9 88.75,59.02 THERMAL.7
TX
  Top 0.305: J1.8 11.85,65.15 25,52 35,52 38,49 50,49 55,44 59,44 61,42 65,42 72,35 89.81,35 GPS.4
UT1A-IN
  Top 0.305: J1.40 18.51,24.51 24,30 27,30 28,29 28,27 27.62,26.62
  Top 0.406: R37.1 26.76,23.51 27.75,24.5 27.75,26.5 27.62,26.62 27.5,26.75 27.02,26.75 Q16.2
UT1A-OUT
  Top 0.305: Q16.3 23,26 16,19 16,15.35 UT-1.2
  Top 0.406: Q16.3 25.07,26.32 R38.1 26.75,28.24 R38.1
UT1B-IN
  Top 0.305: J1.38 12.05,27.05 17,32 24.26,32 R49.1
  Top 0.406: R49.1 26.76,34.51 27.75,35.5 27.75,37.5 27.5,37.75 27.02,37.75 Q22.2
UT1B-OUT
  Top 0.305: Q22.3 25,37 25,37.75 26.62,39.38 27.88,39.38 28.5,38.75 28.5,23.5 27,22 21,22 17,18 17,13.81 UT-1.4
  Top 0.406: Q22.3 25.07,37.83 26.62,39.38 R50.1 26.75,39.49 R50.1
UT2A-IN
  Top 0.305: J1.35 5.84,29.59 7.12,30.88 13.88,30.88 25,42 35,42 36.5,40.5 36.5,27.75 35.25,26.5
  Top 0.406: R39.1 34.26,23.51 35.25,24.5 35.25,26.5 35,26.75 34.52,26.75 Q17.2
UT2A-OUT
  Top 0.305: Q17.3 32,26 31,25 31,18 30,17 30,15.35 UT-2.2
  Top 0.406: Q17.3 32.58,26.57 34.25,28.25 34.25,28.74 R40.1
UT2B-IN
  Top 0.305: J1.37 6.05,27.05 7.3,28.3 12.3,28.3 25,41 35,41 36,40 36,38.75 35,37.75
  Top 0.406: R51.1 34.26,34.51 35.25,35.5 35.25,37.5 35,37.75 34.52,37.75 Q23.2
UT2B-OUT
  Top 0.305: Q23.3 32,37 30,35 30,21 28,19 28,14 29,13 29.27,13 UT-2.4
  Top 0.406: Q23.3 32.58,37.83 R52.1 34.25,39.49 R52.1
UT3A-IN
  Top 0.305: J1.33 6.38,32.13 7.65,33.4 10.15,33.4 10.5,33.75 15.75,33.75 25,43 35,43 37,41 37,24 39,22 41,22 42,23 42,23.24 R41.1
  Top 0.406: R41.1 42.26,23.51 43.25,24.5 43.25,26.5 43,26.75 42.52,26.75 Q18.2
UT3A-OUT
  Top 0.305: UT-3.2 43.73,23.73 44,24 44,26.76 R42.1
  Top 0.406: Q18.3 40.58,26.82 R42.1 42.25,28.74 R42.1
UT3B-IN
  Top 0.305: J1.31 6.42,34.67 7.7,35.95 16.95,35.95 25,44 35,44 37.5,41.5 37.5,34.5 39,33 42,33 42.5,33.5 42.5,34.26 R53.1
  Top 0.406: R53.1 42.26,34.51 43.25,35.5 43.25,37.5 43,37.75 42.52,37.75 Q24.2
UT3B-OUT
  Top 0.305: Q24.3 40.58,37.58 42,39 43,39 44,38 44,30 45,29 45,13.81 UT-3.4
  Top 0.406: Q24.3 40.58,37.83 R54.1 42.25,39.49 R54.1
UT4A-IN
  Top 0.305: 51.25,26.5 53,28.25 53,40 50,43 38,43 35,46 25,46 19.8,51.2 7.8,51.2 7.05,51.95 7.05,52.95 5.9,54.1 5.9,54.86 J1.15
  Top 0.406: R43.1 50.26,23.51 51.25,24.5 51.25,26.5 51,26.75 50.52,26.75 Q19.2
UT4A-OUT
  Top 0.305: UT-4.2 54.92,15.08 47,23 47,24.43 Q19.3
  Top 0.406: Q19.3 48.58,26.82 R44.1 50.25,28.49 R44.1
UT4B-IN
  Top 0.305: J1.29 6.46,37.21 7.75,38.5 18.5,38.5 25,45 35,45 38,42 50,42 52,40 52,38 51.12,37.12
  Top 0.406: R55.1 50.26,34.01 51.25,35 51.25,37 51.12,37.12 51,37.25 50.52,37.25 Q25.2
UT4B-OUT
  Top 0.305: UT-4.4 56.46,12.54 46,23 46,33.92 Q25.3
  Top 0.406: Q25.3 48.58,37.08 50.25,38.75 50.25,39.24 R56.1
UT5A-IN
  Top 0.305: J1.18 19.55,52.45 25,47 35,47 38,44 50,44 54,40 54,23 55,22 57,22 57.5,22.5 57.5,23.26 R45.1
  Top 0.406: R45.1 57.26,23.51 58.25,24.5 58.25,26.5 58,26.75 57.52,26.75 Q20.2
UT5A-OUT
  Top 0.305: Q20.3 55.58,26.57 57,28 58,28 59,27 59,22 66,15 72.81,15 | 73,15 72.81,15 | 72.81,15 UT-5.2
  Top 0.406: R46.1 57.26,28.51 55.5,26.75 55.5,26.07 Q20.3
UT5B-IN
  Top 0.305: J1.13 5.77,56.77 5.75,56.8 7.05,55.5 7.05,54.2 7.55,53.7 19.3,53.7 25,48 35,48 38,45 50,45 54.5,40.5 54.5,33.5 55,33 56.26,33 R57.1
  Top 0.406: R57.1 57.26,34.01 58.25,35 58.25,37 58,37.25 57.52,37.25 Q26.2
UT5B-OUT
  Top 0.305: Q26.3 55.58,37.17 56.9,38.5 56.9,38.6 57.25,38.95 58.05,38.95 59,38 59,28 60,27 60,22 65,17 73,17 74,16 74,13.81 UT-5.4
  Top 0.406: R58.1 57.26,38.76 55.5,37 55.5,36.58 Q26.3
UT6A-IN
  Top 0.305: J1.16 19.01,54.99 25,49 35,49 38,46 50,46 55,41 59,41 60,40 60,28 60.5,27.5 60.5,23.5 61.5,22.5 64.5,22.5 65,23 65,23.26 R47.1 65,23.5 66,24.5 66,26.5 65.5,27 65.28,27 Q21.2
UT6A-OUT
  Top 0.305: R48.1 67.5,28.5 81,15 87.81,15 | 88,15 87.81,15 | 87.81,15 UT-6.2
  Top 0.406: Q21.3 63.08,26.82 R48.1 64.75,28.49 R48.1
UT6B-IN
  Top 0.305: J1.11 5.77,59.48 7.05,58.2 7.05,56.75 7.55,56.25 18.75,56.25 25,50 35,50 38,47 50,47 55,42 59,42 60.5,40.5 60.5,35.5 62,34 62.5,33.5 63,33 64,33 65,34 65,34.26 R59.1
  Top 0.406: Q27.2 65.03,37.75 65.5,37.75 65.75,37.5 65.75,35.49 R59.1
UT6B-OUT
  Top 0.305: Q27.3 63.08,37.73 64.7,39.35 65.65,39.35 67,38 67,30 70,27 71,27 81,17 88,17 89,16 89,13.81 UT-6.4
  Top 0.406: Q27.3 63.08,37.83 R60.1 64.75,39.49 R60.1

### Text on the board
silktop: GND | 5V | GND | D6 | 3V3 | A2 | A0 | D3 | D9 | GND | A1 | 3V3 | 5V-BUCK | 5V / PI | 5V / OUT | SCL | SCLK | 3V3 | MOSI | 12C CONNECTIVITY | MPU9250 / MPU6050 | G | CE0 | SDA | MISO | SDA | G | SCL | GND | G | G | SCL | 5V | G | 3V3 | SDA | G | GP12 | GP25 | GP4 | TX | GND | RX | 5V | GND | GP21 | GP19 | GP13 | GP22 | GP24 | GP23 | GP16 | GP6 | GP5 | GP18 | GP20 | GP26 | GP27 | GP17 | GND | GND | 5V | GND | GND | 5V | 5V | 5V | 5V | 5V | GND | 5V | GND